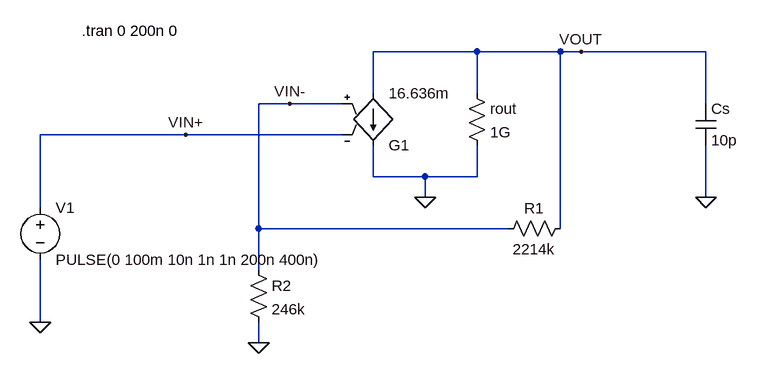
[diagram p0: schematic ota_tema2.asc]
ota_tema2.asc, the LTspice schematic file:
Version 4
SHEET 1 880 680
WIRE 336 48 176 48
WIRE 464 48 336 48
WIRE 496 48 464 48
WIRE 688 48 496 48
WIRE 176 112 176 48
WIRE 336 112 336 48
WIRE 48 128 0 128
WIRE 128 128 48 128
WIRE 688 128 688 48
WIRE -112 176 -336 176
WIRE 128 176 -112 176
WIRE 176 240 176 192
WIRE 256 240 176 240
WIRE 336 240 336 192
WIRE 336 240 256 240
WIRE 256 272 256 240
WIRE 688 272 688 192
WIRE -336 288 -336 176
WIRE 0 320 0 128
WIRE 384 320 0 320
WIRE 464 320 464 48
WIRE 0 384 0 320
WIRE -336 464 -336 368
WIRE 0 496 0 464
FLAG -336 464 0
FLAG 0 496 0
FLAG 256 272 0
FLAG 688 272 0
FLAG -112 176 VIN+
FLAG 48 128 VIN-
FLAG 496 48 VOUT
SYMBOL g2 176 208 M180
SYMATTR InstName G1
SYMATTR Value 16.636m
SYMBOL res 320 96 R0
SYMATTR InstName rout
SYMATTR Value 1G
SYMBOL res -16 368 R0
SYMATTR InstName R2
SYMATTR Value 246k
SYMBOL res 480 304 R90
WINDOW 0 0 56 VBottom 2
WINDOW 3 32 56 VTop 2
SYMATTR InstName R1
SYMATTR Value 2214k
SYMBOL voltage -336 272 R0
WINDOW 123 0 0 Left 0
WINDOW 39 0 0 Left 0
SYMATTR InstName V1
SYMATTR Value PULSE(0 100m 10n 1n 1n 200n 400n)
SYMBOL cap 672 128 R0
SYMATTR InstName Cs
SYMATTR Value 10p
TEXT -272 16 Left 2 !.tran 0 200n 0

The netlist it stands for:
* ota_tema2.asc
G1 VOUT 0 VIN- VIN+ 16.636m
rout VOUT 0 1G
R2 VIN- 0 246k
R1 VOUT VIN- 2214k
V1 VIN+ 0 PULSE(0 100m 10n 1n 1n 200n 400n)
Cs VOUT 0 10p
.tran 0 200n 0
.backanno
.end